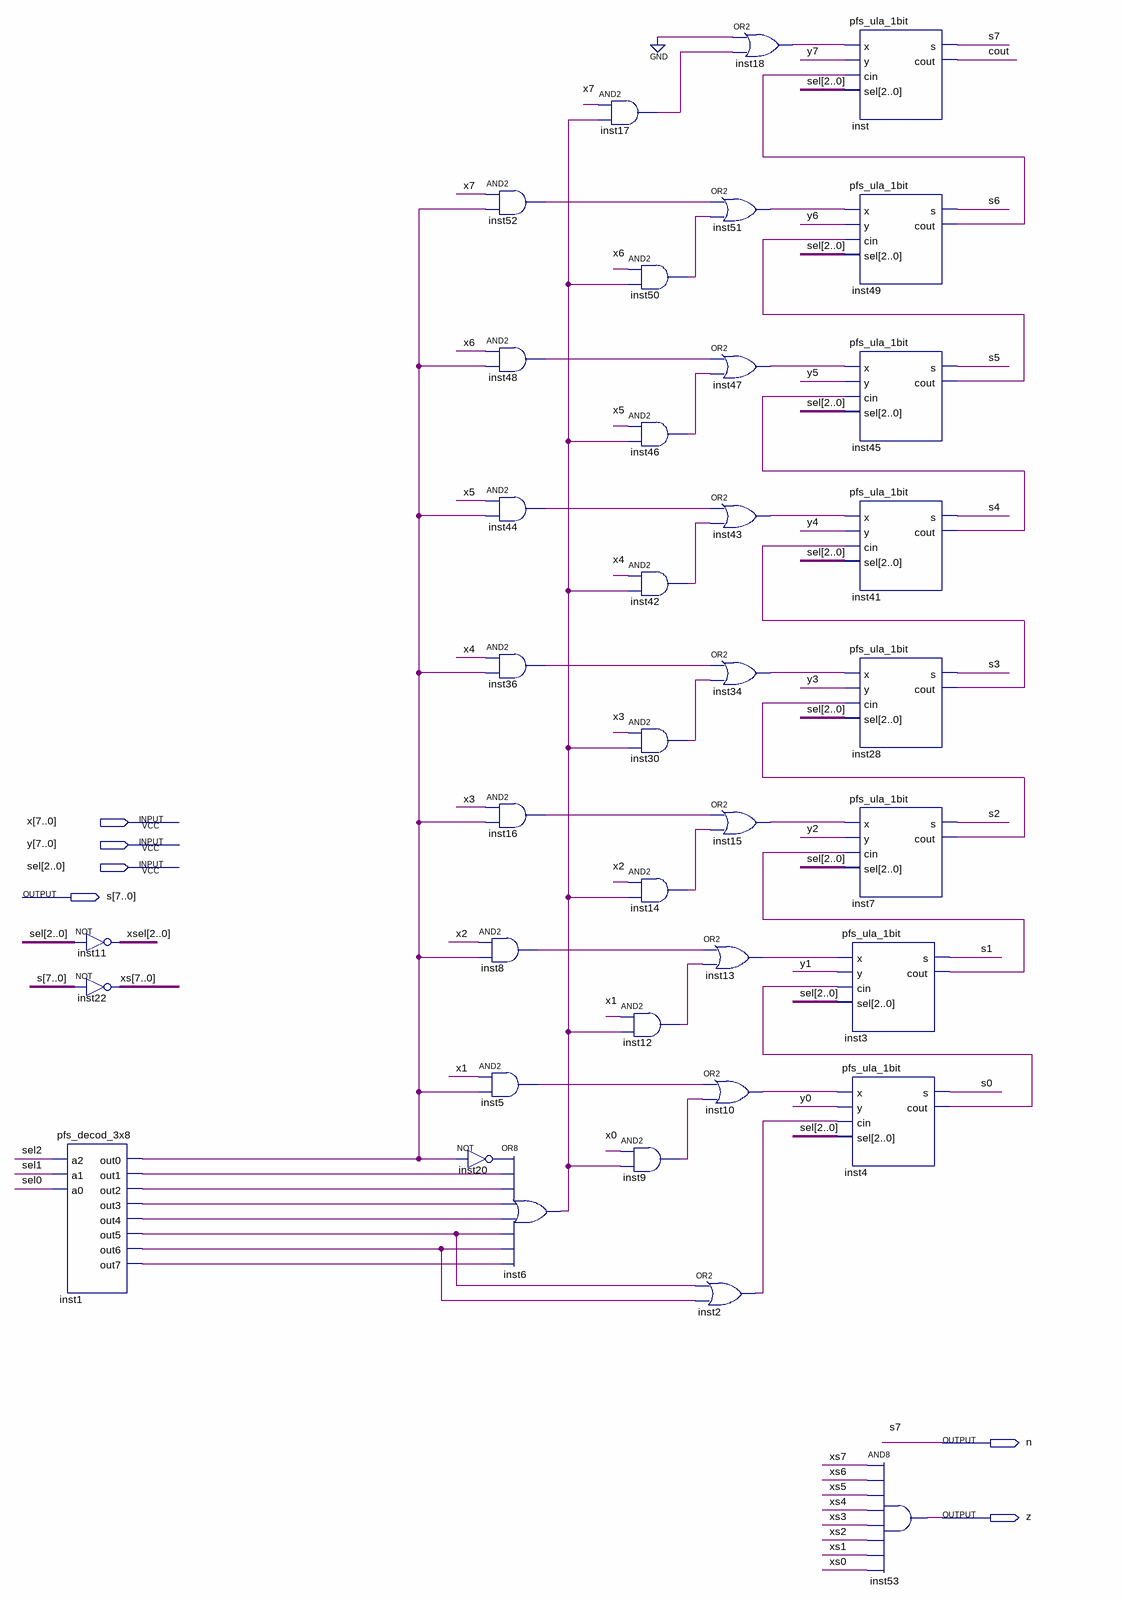
[diagram p0: schematic sheet]
// Quartus schematic pfs_simplified_ula.bdf as structural Verilog: 38 symbols, 6 pins
module pfs_simplified_ula (
  input  [7:0] x,
  input  [7:0] y,
  input  [2:0] sel,
  output [7:0] s,
  output n,
  output z
);

  wire cout, inst1_out0, inst1_out1, inst1_out2, inst1_out3, inst1_out4, inst1_out5, inst1_out6, inst1_out7,
       inst2_out, inst3_cout, inst4_cout, inst5_out, inst6_out, inst7_cout, inst8_out, inst9_out, inst10_out,
       inst12_out, inst13_out, inst14_out, inst15_out, inst16_out, inst17_out, inst18_out, inst20_out,
       inst28_cout, inst30_out, inst34_out, inst36_out, inst41_cout, inst42_out, inst43_out, inst44_out,
       inst45_cout, inst46_out, inst47_out, inst48_out, inst49_cout, inst50_out, inst51_out, inst52_out;
  wire [2:0] xsel;
  wire [7:0] xs;

  assign xsel = ~sel;  // NOT inst11, 3 bits wide
  assign xs = ~{n, s[6:0]};  // NOT inst22, 8 bits wide
  pfs_decod_3x8 inst1 (
    .a2(sel[2]), .a1(sel[1]), .a0(sel[0]), .out0(inst1_out0), .out1(inst1_out1), .out2(inst1_out2),
    .out3(inst1_out3), .out4(inst1_out4), .out5(inst1_out5), .out6(inst1_out6), .out7(inst1_out7));
  not inst20 (inst20_out, inst1_out0);
  and inst52 (inst52_out, x[7], inst1_out0);
  and inst48 (inst48_out, x[6], inst1_out0);
  and inst44 (inst44_out, x[5], inst1_out0);
  and inst36 (inst36_out, x[4], inst1_out0);
  and inst16 (inst16_out, x[3], inst1_out0);
  and inst8 (inst8_out, x[2], inst1_out0);
  and inst5 (inst5_out, x[1], inst1_out0);
  or inst6 (inst6_out, inst20_out, inst1_out1, inst1_out2, inst1_out3, inst1_out4, inst1_out5, inst1_out6, inst1_out7);
  and inst17 (inst17_out, x[7], inst6_out);
  and inst50 (inst50_out, x[6], inst6_out);
  and inst46 (inst46_out, x[5], inst6_out);
  and inst42 (inst42_out, x[4], inst6_out);
  and inst30 (inst30_out, x[3], inst6_out);
  and inst14 (inst14_out, x[2], inst6_out);
  and inst12 (inst12_out, x[1], inst6_out);
  and inst9 (inst9_out, x[0], inst6_out);
  or inst2 (inst2_out, inst1_out5, inst1_out6);
  or inst18 (inst18_out, 1'b0, inst17_out);
  or inst51 (inst51_out, inst52_out, inst50_out);
  or inst47 (inst47_out, inst48_out, inst46_out);
  or inst43 (inst43_out, inst44_out, inst42_out);
  or inst34 (inst34_out, inst36_out, inst30_out);
  or inst15 (inst15_out, inst16_out, inst14_out);
  or inst13 (inst13_out, inst8_out, inst12_out);
  or inst10 (inst10_out, inst5_out, inst9_out);
  pfs_ula_1bit inst (.x(inst18_out), .y(y[7]), .cin(inst49_cout), .sel(sel), .s(n), .cout(cout));
  pfs_ula_1bit inst49 (.x(inst51_out), .y(y[6]), .cin(inst45_cout), .sel(sel), .s(s[6]), .cout(inst49_cout));
  pfs_ula_1bit inst45 (.x(inst47_out), .y(y[5]), .cin(inst41_cout), .sel(sel), .s(s[5]), .cout(inst45_cout));
  pfs_ula_1bit inst41 (.x(inst43_out), .y(y[4]), .cin(inst28_cout), .sel(sel), .s(s[4]), .cout(inst41_cout));
  pfs_ula_1bit inst28 (.x(inst34_out), .y(y[3]), .cin(inst7_cout), .sel(sel), .s(s[3]), .cout(inst28_cout));
  pfs_ula_1bit inst7 (.x(inst15_out), .y(y[2]), .cin(inst3_cout), .sel(sel), .s(s[2]), .cout(inst7_cout));
  pfs_ula_1bit inst3 (.x(inst13_out), .y(y[1]), .cin(inst4_cout), .sel(sel), .s(s[1]), .cout(inst3_cout));
  pfs_ula_1bit inst4 (.x(inst10_out), .y(y[0]), .cin(inst2_out), .sel(sel), .s(s[0]), .cout(inst4_cout));
  and inst53 (z, xs[7], xs[6], xs[5], xs[4], xs[3], xs[2], xs[1], xs[0]);

  assign s[7] = n;

  // Other names for the same wires on the sheet: s7 = n
endmodule
